# EAGLE design ws2812_Sqaure_V01 (EAGLE 7.7.0)
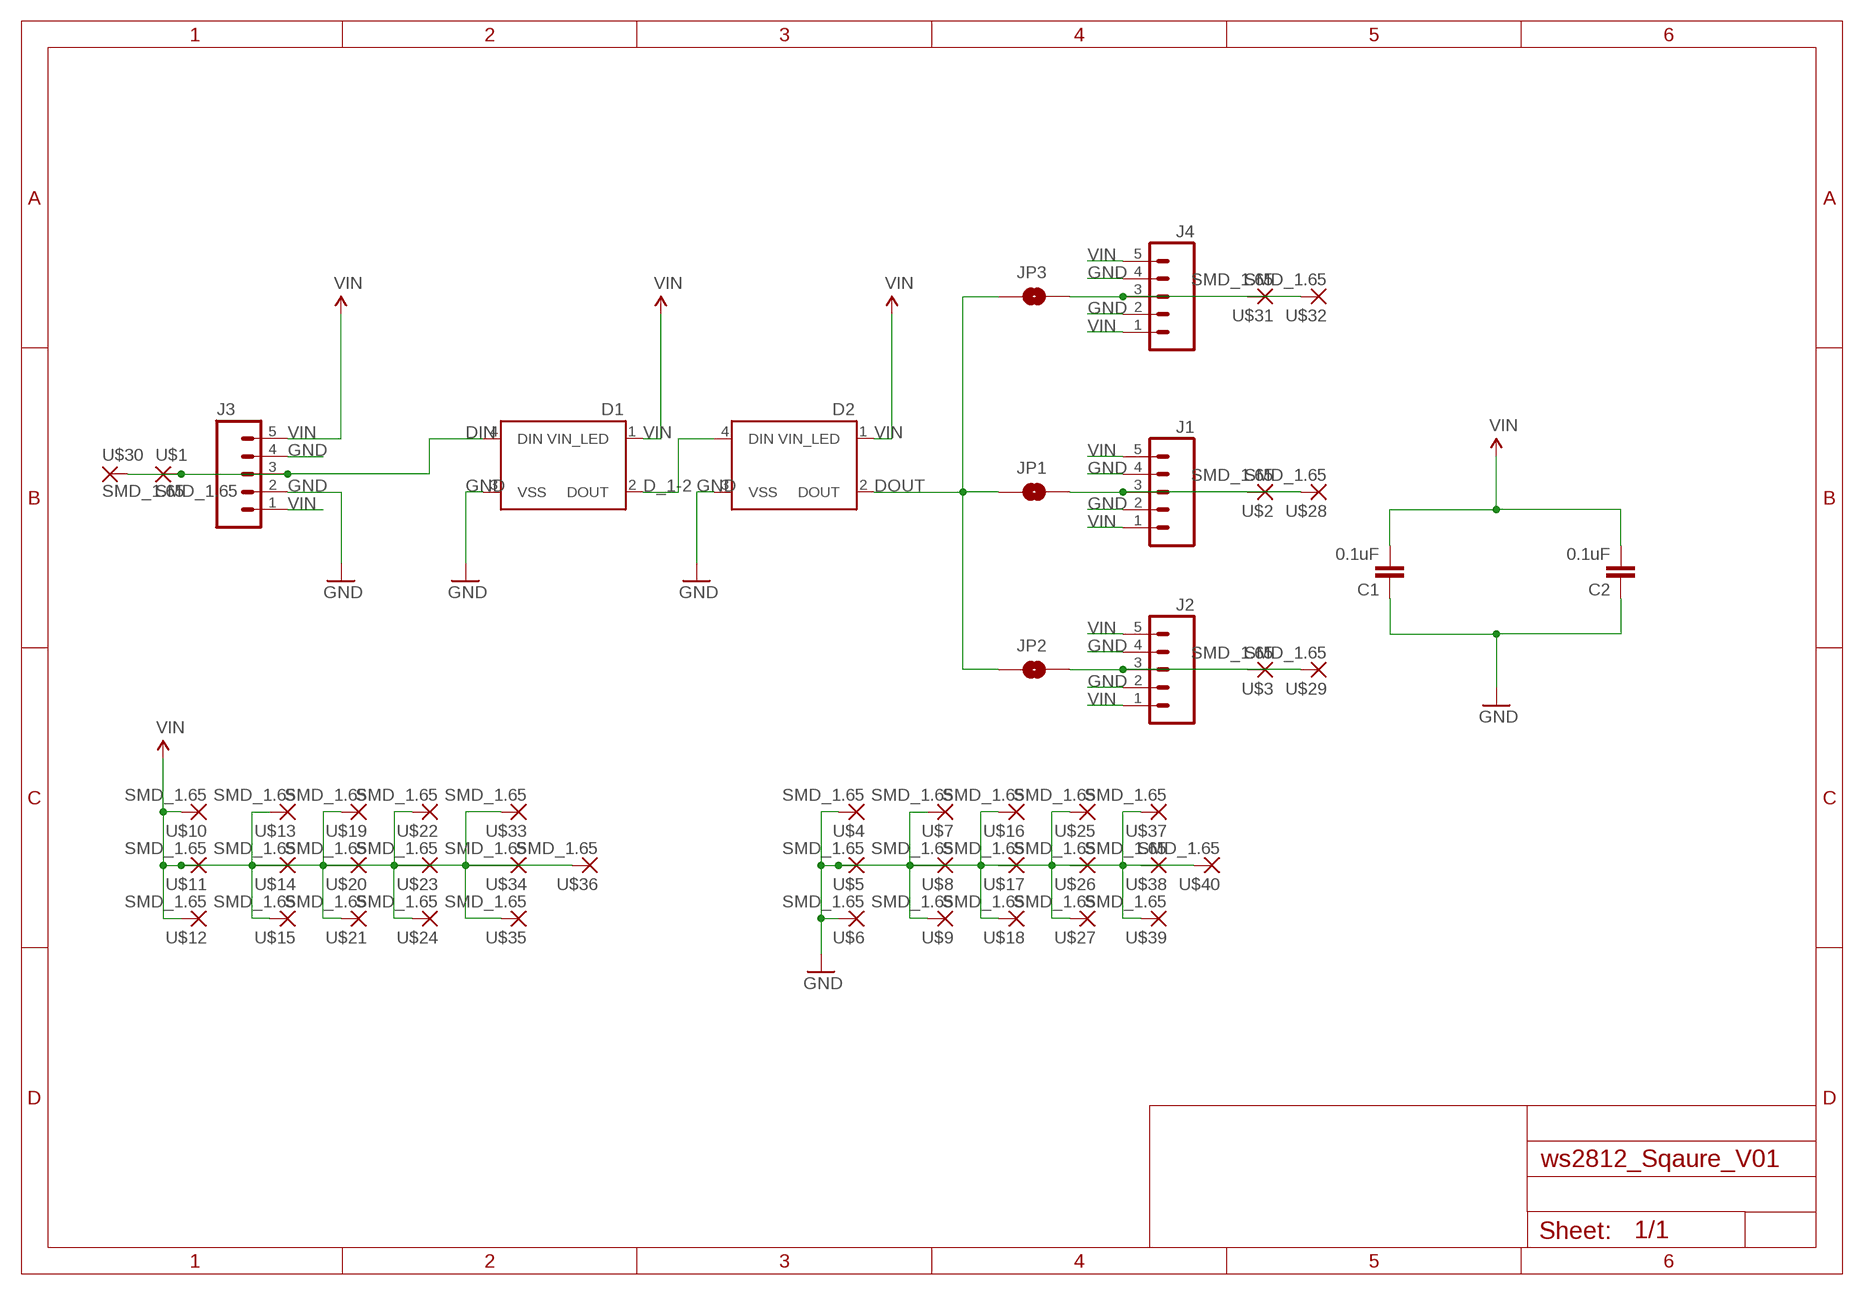
[diagram p0: schematic, sheet 1]

## Parts
C1  0.1uF  CAP0805  [0805]
C2  0.1uF  CAP0805  [0805]
D1  WS2812B  [WS2812B]
D2  WS2812B  [WS2812B]
J1  M05NO_SILK  [1X05_NO_SILK]
J2  M05NO_SILK  [1X05_NO_SILK]
J3  M05NO_SILK  [1X05_NO_SILK]
J4  M05NO_SILK  [1X05_NO_SILK]
JP1  JUMPER-PAD-2-NOYES_SILK  [PAD-JUMPER-2-NO_YES_SILK]
JP2  JUMPER-PAD-2-NOYES_SILK  [PAD-JUMPER-2-NO_YES_SILK]
JP3  JUMPER-PAD-2-NOYES_SILK  [PAD-JUMPER-2-NO_YES_SILK]
U$1  SMD_1.65  [SMD_PTH_1.65]
U$2  SMD_1.65  [SMD_PTH_1.65]
U$3  SMD_1.65  [SMD_PTH_1.65]
U$4  SMD_1.65  [SMD_PTH_1.65]
U$5  SMD_1.65  [SMD_PTH_1.65]
U$6  SMD_1.65  [SMD_PTH_1.65]
U$7  SMD_1.65  [SMD_PTH_1.65]
U$8  SMD_1.65  [SMD_PTH_1.65]
U$9  SMD_1.65  [SMD_PTH_1.65]
U$10  SMD_1.65  [SMD_PTH_1.65]
U$11  SMD_1.65  [SMD_PTH_1.65]
U$12  SMD_1.65  [SMD_PTH_1.65]
U$13  SMD_1.65  [SMD_PTH_1.65]
U$14  SMD_1.65  [SMD_PTH_1.65]
U$15  SMD_1.65  [SMD_PTH_1.65]
U$16  SMD_1.65  [SMD_PTH_1.65]
U$17  SMD_1.65  [SMD_PTH_1.65]
U$18  SMD_1.65  [SMD_PTH_1.65]
U$19  SMD_1.65  [SMD_PTH_1.65]
U$20  SMD_1.65  [SMD_PTH_1.65]
U$21  SMD_1.65  [SMD_PTH_1.65]
U$22  SMD_1.65  [SMD_PTH_1.65]
U$23  SMD_1.65  [SMD_PTH_1.65]
U$24  SMD_1.65  [SMD_PTH_1.65]
U$25  SMD_1.65  [SMD_PTH_1.65]
U$26  SMD_1.65  [SMD_PTH_1.65]
U$27  SMD_1.65  [SMD_PTH_1.65]
U$28  SMD_1.65  [SMD_PTH_1.65]
U$29  SMD_1.65  [SMD_PTH_1.65]
U$30  SMD_1.65  [SMD_PTH_1.65]
U$31  SMD_1.65  [SMD_PTH_1.65]
U$32  SMD_1.65  [SMD_PTH_1.65]
U$33  SMD_1.65  [SMD_PTH_1.65]
U$34  SMD_1.65  [SMD_PTH_1.65]
U$35  SMD_1.65  [SMD_PTH_1.65]
U$36  SMD_1.65  [SMD_PTH_1.65]
U$37  SMD_1.65  [SMD_PTH_1.65]
U$38  SMD_1.65  [SMD_PTH_1.65]
U$39  SMD_1.65  [SMD_PTH_1.65]
U$40  SMD_1.65  [SMD_PTH_1.65]

## Nets
D_1-2: D1.2(DOUT) D2.4(DIN)
DIN: D1.4(DIN) J3.3 U$1.P$1(P) U$30.P$1(P)
DOUT: D2.2(DOUT) JP1.1 JP2.1 JP3.1
GND: C1.1 C2.1 D1.3(VSS) D2.3(VSS) J1.2 J1.4 J2.2 J2.4 J3.2 J3.4 J4.2 J4.4 U$4.P$1(P) U$5.P$1(P) U$6.P$1(P) U$7.P$1(P) U$8.P$1(P) U$9.P$1(P) U$16.P$1(P) U$17.P$1(P) U$18.P$1(P) U$25.P$1(P) U$26.P$1(P) U$27.P$1(P) U$37.P$1(P) U$38.P$1(P) U$39.P$1(P) U$40.P$1(P)
N$1: J2.3 JP2.2 U$3.P$1(P) U$29.P$1(P)
N$2: J1.3 JP1.2 U$2.P$1(P) U$28.P$1(P)
N$3: J4.3 JP3.2 U$31.P$1(P) U$32.P$1(P)
VIN: C1.2 C2.2 D1.1(VIN_LED) D2.1(VIN_LED) J1.1 J1.5 J2.1 J2.5 J3.1 J3.5 J4.1 J4.5 U$10.P$1(P) U$11.P$1(P) U$12.P$1(P) U$13.P$1(P) U$14.P$1(P) U$15.P$1(P) U$19.P$1(P) U$20.P$1(P) U$21.P$1(P) U$22.P$1(P) U$23.P$1(P) U$24.P$1(P) U$33.P$1(P) U$34.P$1(P) U$35.P$1(P) U$36.P$1(P)

## Library data of the parts
C1 C2 = SparkFun-Capacitors:CAP: Capacitor Standard 0603 ceramic capacitor, and 0.1" leaded capacitor.
D1 D2 = SparkFun-LED:WS2812B: WS2812B - Intelligent control LED integrated light source Technical Specifications: Power Supply Voltage (VDD): 3.5 to 5.3 V Input Voltage (VI): -0.5 to VDD+0.5 V Operating Junction Temperature (Topt): -25°C to +80°C Storage Temperature Range (Tstg): -55°C to +150°C; PROD_ID: DIO-12503
J1-J4 = SparkFun-Connectors:M05: Header 5 Standard 5-pin 0.1" header. Use with straight break away headers (SKU : PRT-00116), right angle break away headers (PRT-00553), swiss pins (PRT-00743), machine pins (PRT-00117), and female headers (PRT-00115). Molex polarized connector foot print use with SKU : PRT-08230 with associated crimp pins and housings.
JP1-JP3 = SparkFun-Passives:JUMPER-PAD-2-NO
U$1-U$40 = Modified_wirepad:SMD_1.65

## Board
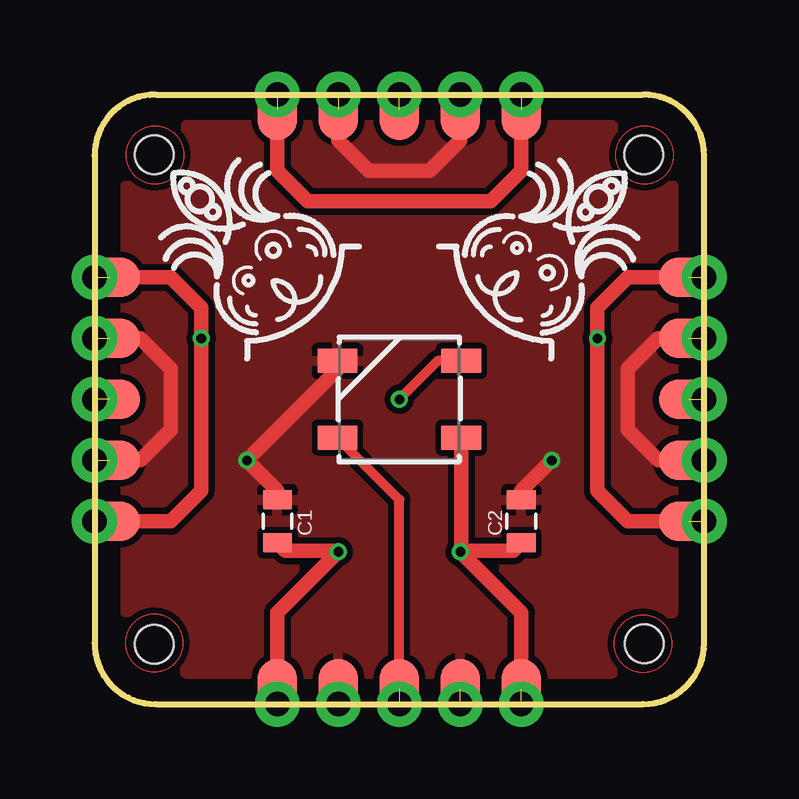
[diagram p1: board, top side]
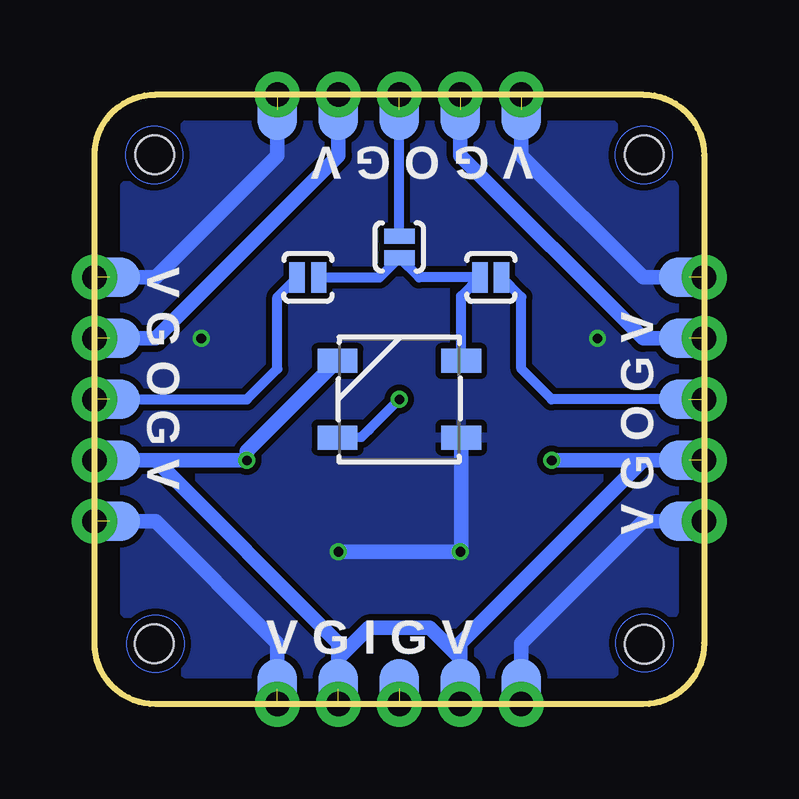
[diagram p2: board, bottom side, seen from below]

Size 25.4 x 25.4 mm. Coordinates in mm from the lower left corner, seen from the top.
Outline: 2.54,0 22.86,0 arc90 25.4,2.54 25.4,22.86 arc90 22.86,25.4 2.54,25.4 arc90 0,22.86 0,2.54 arc90 2.54,0
Copper layers (1*16): Top 0.035mm / dielectric 1.5mm / Bottom 0.035mm
Design rules "SeeedStudio_2layer_DRU_no_angle_20140221": minimum track width 6mil, minimum drill 12mil, track to track 6mil, track to pad 6mil, pad to pad 6mil, via to via 6mil, smd to smd 0mil, copper to edge 10mil, drill to drill 10mil, minimum pad ring 10mil, minimum via ring 6mil, stop-mask expansion 2mil, vias tented up to drill 100mil, thermal gap 10mil
Holes 1.6 mm at 2.49,2.49 2.49,22.89 22.91,2.51 22.89,22.89

### Footprints (pad centres in the part's own frame; a part is rotated, then mirrored left to right if it is on the bottom)
0805 = smd 0.8 x 1.2: 1 -0.9,0; 2 0.9,0
WS2812B = smd 1.651 x 1: 1 -2.577,1.6; 2 -2.577,-1.6; 3 2.577,-1.6; 4 2.577,1.6
1X05_NO_SILK = drill 1.016 pad 1.88: 1 0,0; 2 2.54,0; 3 5.08,0; 4 7.62,0; 5 10.16,0
PAD-JUMPER-2-NO_YES_SILK = smd 0.635 x 1.27: 1 -0.45,0; 2 0.45,0
SMD_PTH_1.65 = smd 1.65 x 2.5: P$1 0,0.635

### Placement (x,y rotation side)
C1  7.62,7.62 270 top
C2  17.78,7.62 270 top
D1  12.7,12.7 180 top
D2  12.7,12.7 180 bottom
J1  25.4,7.62 90 top
J2  17.78,25.4 180 top
J3  7.62,0 0 top
J4  0,17.78 270 top
JP1  16.51,17.78 180 bottom
JP2  12.7,19.05 90 bottom
JP3  8.89,17.78 0 bottom
U$1  12.7,0 0 bottom
U$2  25.4,12.7 270 bottom
U$3  12.7,25.4 180 bottom
U$4  10.16,0 0 bottom
U$5  15.24,0 0 bottom
U$6  25.4,15.24 270 bottom
U$7  25.4,10.16 270 bottom
U$8  15.24,25.4 180 bottom
U$9  10.16,25.4 180 bottom
U$10  17.78,0 0 bottom
U$11  7.62,0 0 bottom
U$12  25.4,7.62 270 bottom
U$13  25.4,17.78 270 bottom
U$14  17.78,25.4 180 bottom
U$15  7.62,25.4 180 bottom
U$16  10.16,0 0 top
U$17  15.24,0 0 top
U$18  15.24,25.4 180 top
U$19  17.78,25.4 180 top
U$20  7.62,0 0 top
U$21  17.78,0 0 top
U$22  7.62,25.4 180 top
U$23  25.4,7.62 90 top
U$24  25.4,17.78 90 top
U$25  10.16,25.4 180 top
U$26  25.4,10.16 90 top
U$27  25.4,15.24 90 top
U$28  25.4,12.7 90 top
U$29  12.7,25.4 180 top
U$30  12.7,0 0 top
U$31  0,12.7 90 bottom
U$32  0,12.7 270 top
U$33  0,17.78 270 top
U$34  0,7.62 270 top
U$35  0,7.62 90 bottom
U$36  0,17.78 90 bottom
U$37  0,15.24 270 top
U$38  0,15.24 90 bottom
U$39  0,10.16 90 bottom
U$40  0,10.16 270 top

### Tracks (layer width: path | path; a pad name or v marks a point on that pad's centre or on a via)
D_1-2  (via drill 0.4)
  Top 0.406: D1.2 14.3,14.3 v12.7,12.7
  Bottom 0.406: v12.7,12.7 13.97,11.43 14.29,11.12 D2.4
DIN  (2 unrouted)
  Top 0.406: U$30.P$1 12.7,8.52 D1.4
DOUT
  Bottom 0.406: JP1.1 13.52,17.78 JP2.1 11.88,17.78 JP3.1 10.12,17 D2.2
GND  (via drill 0.4)  (11 unrouted)
  Top 0.61: C2.1 17.78,8.89 v19.05,10.16 | C1.1 7.62,8.89 v6.35,10.16 10.12,13.93 D1.3 | U$25.P$1 10.16,23.5 11.43,22.23 13.97,22.23 15.24,23.5 U$18.P$1 | U$40.P$1 1.91,10.16 3.17,11.43 3.17,13.97 1.91,15.24 U$38.P$1 | U$26.P$1 23.5,10.16 22.23,11.43 22.23,13.97 23.5,15.24 U$27.P$1
  Bottom 0.61: U$40.P$1 2.54,10.16 | 2.54,10.16 10.16,2.54 U$16.P$1 | U$16.P$1 J3.2 | J1.2 U$26.P$1 | U$26.P$1 22.86,10.16 15.24,2.54 15.24,1.91 | 15.24,1.91 U$17.P$1 | U$27.P$1 22.86,15.24 15.24,22.86 J2.2 | U$38.P$1 2.54,15.24 10.16,22.86 U$25.P$1 | D2.3 19.05,10.53 v19.05,10.16 U$26.P$1 | v6.35,10.16 2.54,10.16 | U$16.P$1 10.16,1.91 11.43,3.17 13.97,3.17 15.24,1.91
  pour Top (isolate 0.254): 3.81,1.27 21.59,1.27 24.13,3.81 24.13,21.59 21.59,24.13 3.81,24.13 1.27,21.59 1.27,3.81
N$1  (2 unrouted)
  Bottom 0.406: JP2.2 U$29.P$1
N$2  (2 unrouted)
  Bottom 0.406: U$28.P$1 19.05,12.7 17.78,13.97 17.78,16.96 JP1.2
N$3  (2 unrouted)
  Bottom 0.406: U$32.P$1 6.35,12.7 7.62,13.97 7.62,16.96 JP3.2
VIN  (via drill 0.4)  (14 unrouted)
  Top 0.61: J3.1 7.62,3.81 v10.16,6.35 10.16,6.39 7.95,6.39 C1.2 | D1.1 15.28,6.39 | 15.28,6.39 v15.24,6.35 17.78,3.81 U$21.P$1 | 15.28,6.39 17.45,6.39 C2.2 | U$36.P$1 3.17,17.78 4.45,16.51 v4.45,15.24 4.45,8.89 3.17,7.62 J4.5 | U$24.P$1 22.23,17.78 20.95,16.51 v20.95,15.24 20.95,8.89 22.23,7.62 J1.1 | U$22.P$1 7.62,22.23 8.89,20.95 16.51,20.95 17.78,22.23 J2.1
  Bottom 0.61: U$21.P$1 17.78,2.54 22.86,7.62 U$23.P$1 | U$20.P$1 7.62,2.54 2.54,7.62 J4.5 | U$36.P$1 2.54,17.78 7.62,22.86 U$22.P$1 | U$24.P$1 22.86,17.78 17.78,22.86 U$19.P$1 | v15.24,6.35 v10.16,6.35 10.12,6.35 D2.1
  pour Bottom (isolate 0.254): 1.27,5.08 1.27,3.81 3.81,1.27 21.59,1.27 24.13,3.81 24.13,21.59 21.59,24.13 3.81,24.13 1.27,21.59
(copper drawn outside any net)
  shapes: Bottom circle x4, Top circle x4

### Text on the board
bPlace: V G O G V | V G O G V | V G O G V | V G I G V